# EAGLE design fc_board_rev_1 (EAGLE 5.12)
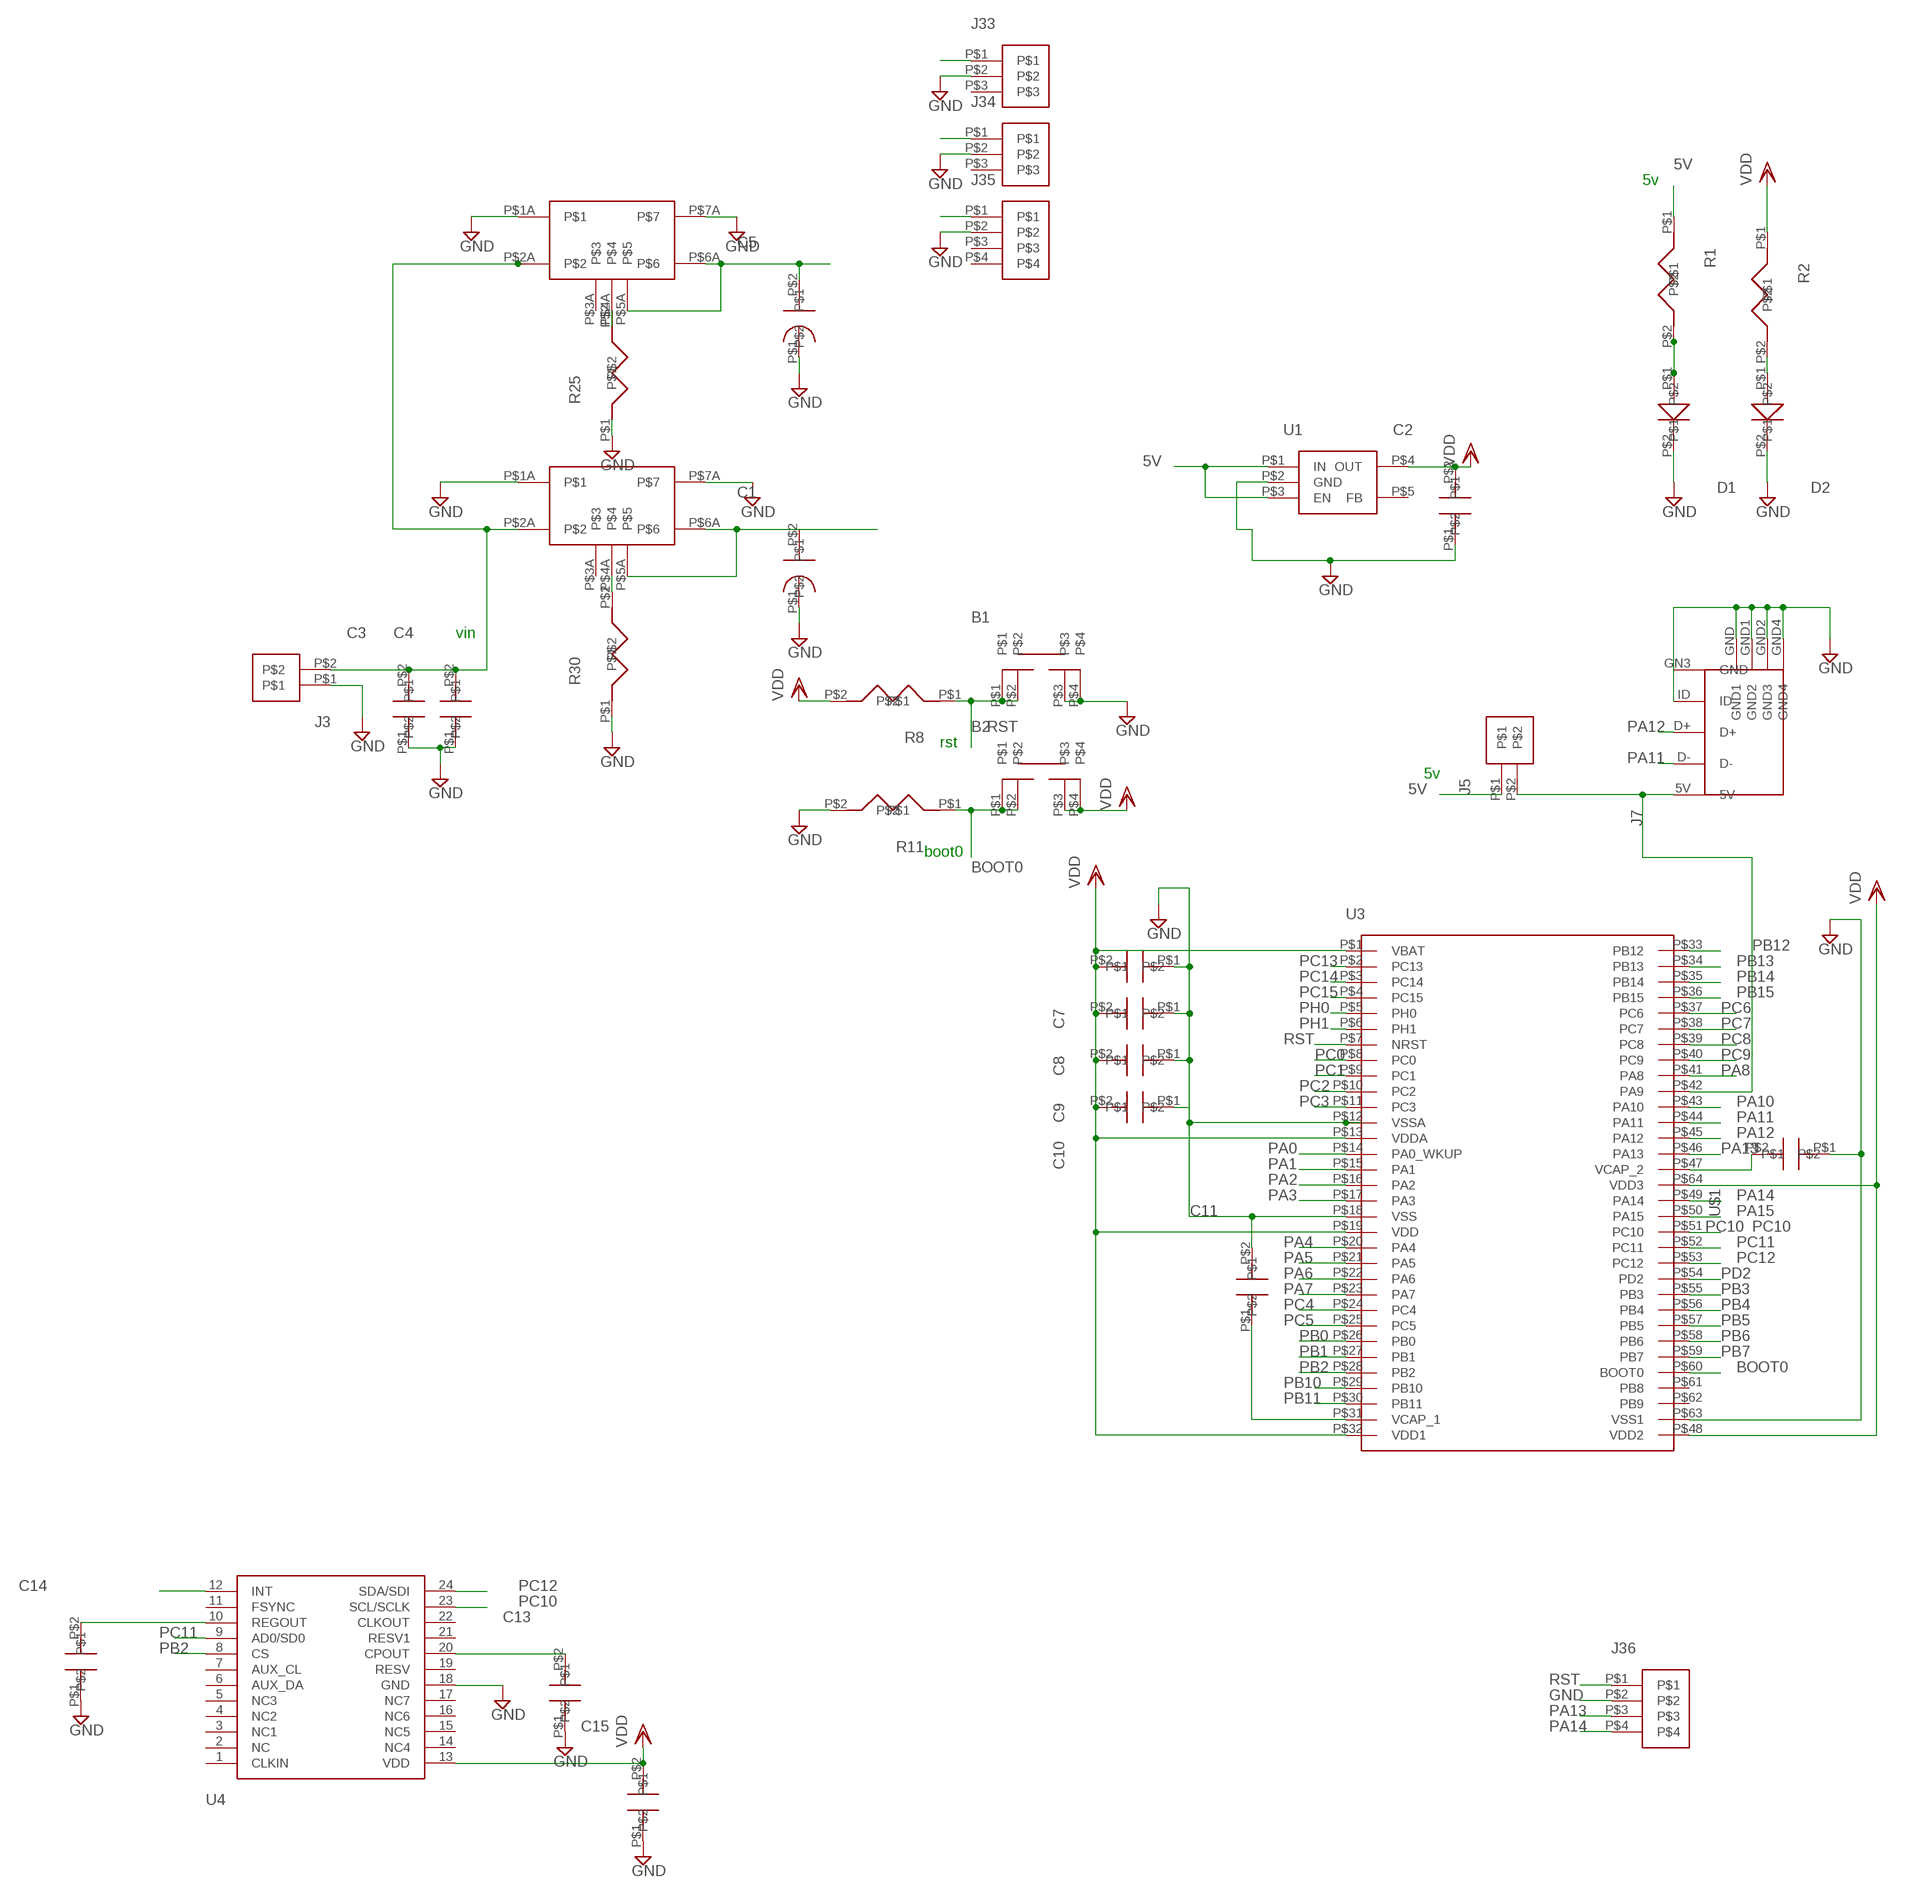
[diagram p0: schematic, sheet 1, part 1 of 2]
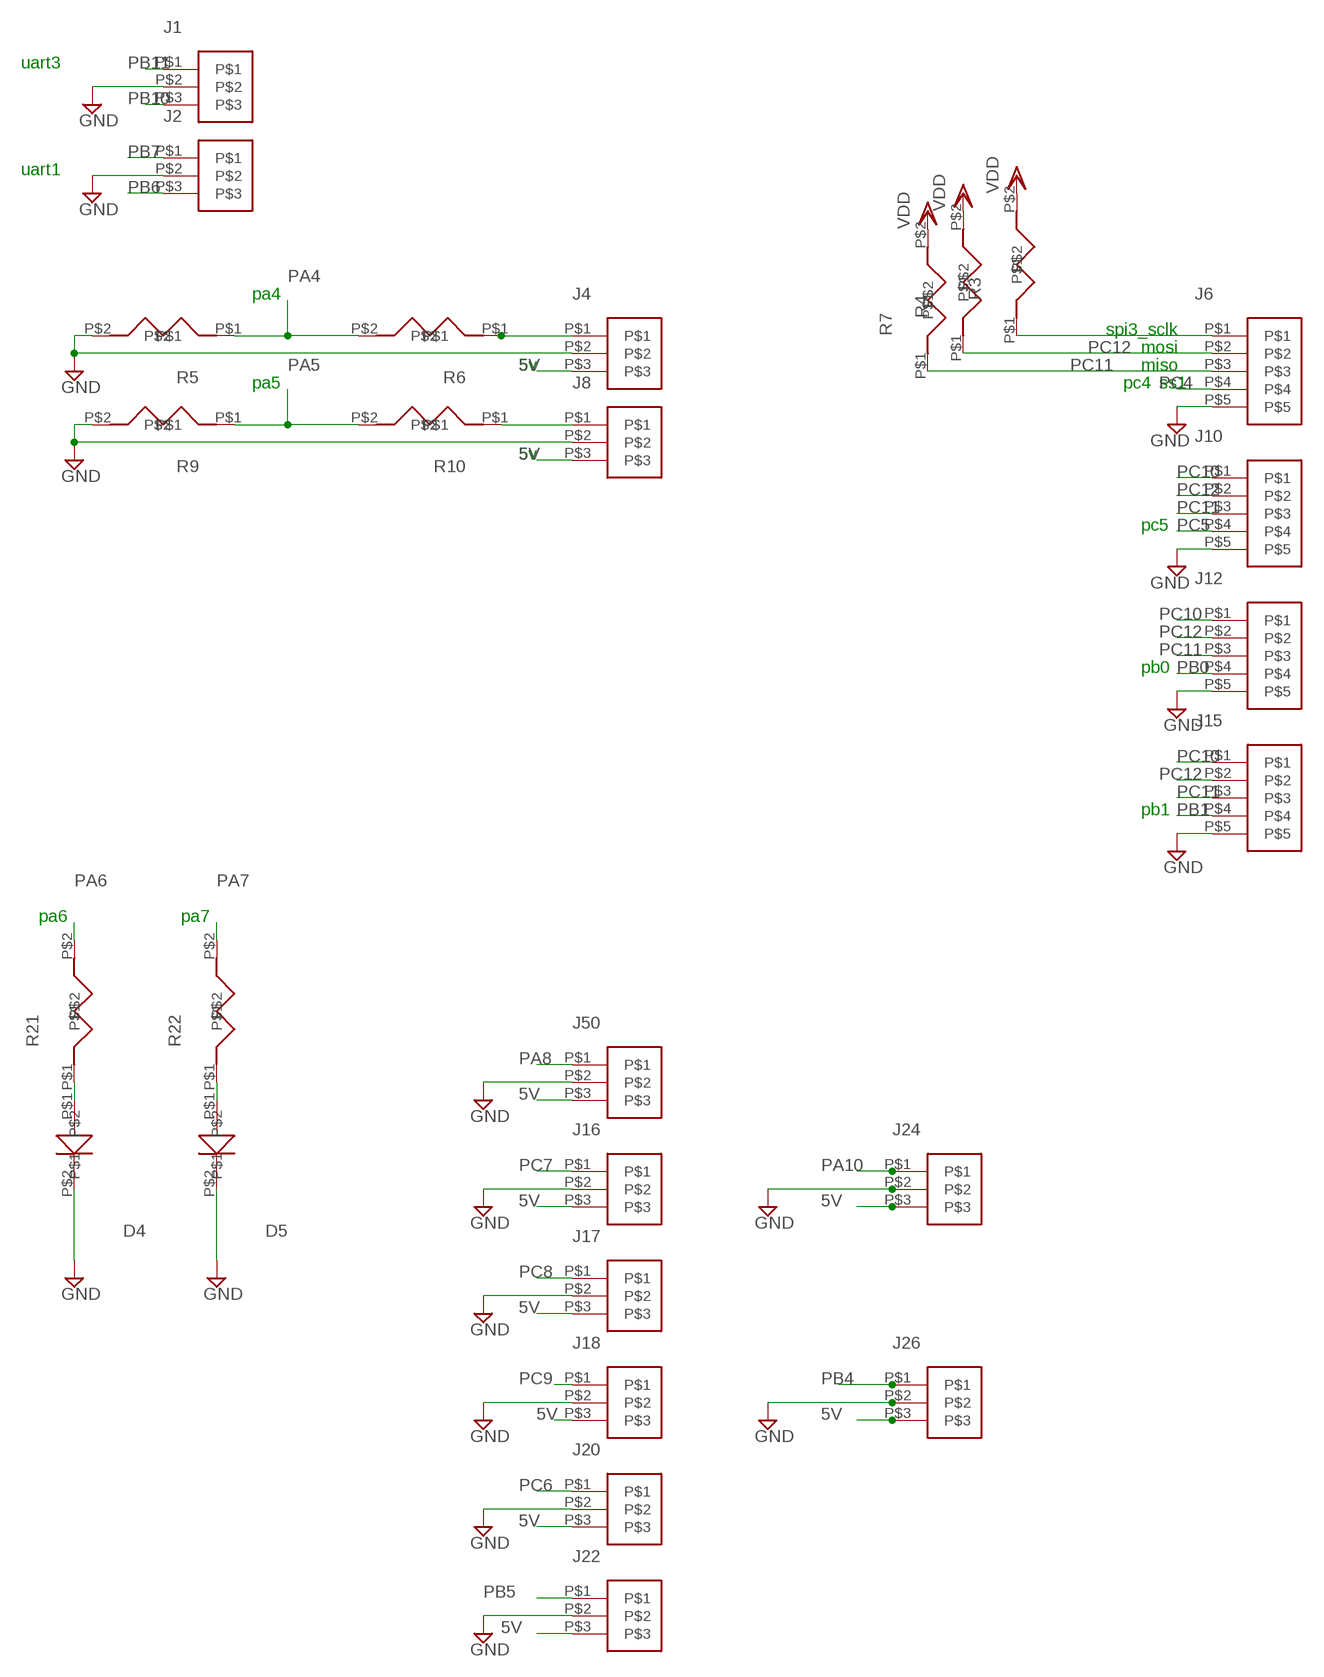
[diagram p1: schematic, sheet 1, part 2 of 2]

## Parts
B1  SM-BUTTON  [SM_BUTTON]
B2  SM-BUTTON  [SM_BUTTON]
C1  CAPACITOR-330UF  [330UF-CAPACITOR]
C2  2.2UF-CAP  [0603-CAPACITOR]
C3  2.2UF-CAP  [0603-CAPACITOR]
C4  2.2UF-CAP  [0603-CAPACITOR]
C5  CAPACITOR-330UF  [330UF-CAPACITOR]
C7  CAPACITOR-.1UF-4V  [0603-CAPACITOR]
C8  CAPACITOR-.1UF-4V  [0603-CAPACITOR]
C9  CAPACITOR-.1UF-4V  [0603-CAPACITOR]
C10  4.7UF-CAP6.3V  [0603-CAPACITOR]
C11  2.2UF-CAP  [0603-CAPACITOR]
C13  CAPACITOR-2.2NF-50V  [0603-CAPACITOR]
C14  CAPACITOR-.1UF-4V  [0603-CAPACITOR]
C15  CAPACITOR-.1UF-4V  [0603-CAPACITOR]
D1  RED_LED  [0603-CAPACITOR]
D2  RED_LED  [0603-CAPACITOR]
D4  RED_LED  [0603-CAPACITOR]
D5  ORANGE_LED  [0603-CAPACITOR]
J1  3-PIN-SHERLOCK  [3-PIN-2MM]
J2  3-PIN-SHERLOCK  [3-PIN-2MM]
J3  2-PIN-POWER  [2-PIN-3MM]
J4  3-PIN-SHERLOCK  [3-PIN-2MM]
J5  2-PIN-100MIL  [2PIN-100MIL]
J6  5-PIN-SHERLOCK  [5-PIN-2MM]
J7  USB_MINI_B  [USB_MINI_B]
J8  3-PIN-SHERLOCK  [3-PIN-2MM]
J10  5-PIN-SHERLOCK  [5-PIN-2MM]
J12  5-PIN-SHERLOCK  [5-PIN-2MM]
J15  5-PIN-SHERLOCK  [5-PIN-2MM]
J16  3-PIN-100-MIL  [3-PIN-10MIL]
J17  3-PIN-100-MIL  [3-PIN-10MIL]
J18  3-PIN-100-MIL  [3-PIN-10MIL]
J20  3-PIN-100-MIL  [3-PIN-10MIL]
J22  3-PIN-100-MIL  [3-PIN-10MIL]
J24  3-PIN-100-MIL  [3-PIN-10MIL]
J26  3-PIN-100-MIL  [3-PIN-10MIL]
J33  3-PIN-3MM  [3-PIN-3MM]
J34  3-PIN-3MM  [3-PIN-3MM]
J35  4-PIN-3MM  [4-PIN-3MM]
J36  4-PIN-SHERLOCK  [4-PIN-2MM]
J50  3-PIN-100-MIL  [3-PIN-10MIL]
R1  RESISTOR-4.7K-25V  [0603-CAPACITOR]
R2  RESISTOR-4.7K-25V  [0603-CAPACITOR]
R3  RESISTOR-4.7K-25V  [0603-CAPACITOR]
R4  RESISTOR-4.7K-25V  [0603-CAPACITOR]
R5  10K_RESISTOR  [0603-CAPACITOR]
R6  10K_RESISTOR  [0603-CAPACITOR]
R7  RESISTOR-4.7K-25V  [0603-CAPACITOR]
R8  RESISTOR-4.7K-25V  [0603-CAPACITOR]
R9  10K_RESISTOR  [0603-CAPACITOR]
R10  10K_RESISTOR  [0603-CAPACITOR]
R11  RESISTOR-4.7K-25V  [0603-CAPACITOR]
R21  RESISTOR-4.7K-25V  [0603-CAPACITOR]
R22  RESISTOR-4.7K-25V  [0603-CAPACITOR]
R25  732_RESISTOR  [0603-CAPACITOR]
R30  21K_RESISTOR  [0603-CAPACITOR]
U1  TPS73433-3.3-REG  [TPS73433-SOT5]
U3  STM32F405RG  [LQFP-64-STM32F405]
U4  MPU-6000  [QFN-ITG3200]
U$1  2.2UF-CAP  [0603-CAPACITOR]
U$2  WIDE_IN_REG  [WIDE_IN_REG]
U$4  WIDE_IN_REG  [WIDE_IN_REG]

## Nets
5V: C1.P$2 J4.P$3 J5.P$1 J8.P$3 J16.P$3 J17.P$3 J18.P$3 J20.P$3 J22.P$3 J24.P$3 J26.P$3 J33.P$1 J34.P$1 J50.P$3 R1.P$1 U1.P$1(IN) U1.P$3(EN) U$2.P$5A U$2.P$6A
12V: C5.P$2 J35.P$1 U$4.P$5A U$4.P$6A
BOOT0: B2.P$1 B2.P$2 R11.P$1 U3.P$60(BOOT0)
GND: B1.P$3 B1.P$4 C1.P$1 C2.P$1 C3.P$1 C4.P$1 C5.P$1 C7.P$1 C8.P$1 C9.P$1 C10.P$1 C11.P$2 C13.P$1 C14.P$1 C15.P$1 D1.P$2 D2.P$2 D4.P$2 D5.P$2 J1.P$2 J2.P$2 J3.P$1 J4.P$2 J6.P$5 J7.GN3(GND) J7.GND1(GND2) J7.GND2(GND3) J7.GND4 J7.GND(GND1) J7.ID J8.P$2 J10.P$5 J12.P$5 J15.P$5 J16.P$2 J17.P$2 J18.P$2 J20.P$2 J22.P$2 J24.P$2 J26.P$2 J33.P$2 J34.P$2 J35.P$2 J36.P$2 J50.P$2 R5.P$2 R9.P$2 R11.P$2 R25.P$1 R30.P$1 U1.P$2(GND) U3.P$12(VSSA) U3.P$18(VSS) U3.P$63(VSS1) U4.18(GND) U$1.P$1 U$2.P$1A U$2.P$7A U$4.P$1A U$4.P$7A
ITG3200_INT: U4.12(INT)
N$1: C13.P$2 U4.20(CPOUT)
N$3: J4.P$1 R6.P$1
N$4: D4.P$1 R21.P$1
N$5: R30.P$2 U$2.P$4A
N$6: J8.P$1 R10.P$1
N$7: D5.P$1 R22.P$1
N$8: U3.P$47(VCAP_2) U$1.P$2
N$9: C11.P$1 U3.P$31(VCAP_1)
N$10: D2.P$1 R2.P$2
N$12: D1.P$1 R1.P$2
N$15: R25.P$2 U$4.P$4A
N$16: C14.P$2 U4.10(REGOUT)
PA0: U3.P$14(PA0_WKUP)
PA1: U3.P$15(PA1)
PA2: U3.P$16(PA2)
PA3: U3.P$17(PA3)
PA4: R5.P$1 R6.P$2 U3.P$20(PA4)
PA5: R9.P$1 R10.P$2 U3.P$21(PA5)
PA6: R21.P$2 U3.P$22(PA6)
PA7: R22.P$2 U3.P$23(PA7)
PA8: J50.P$1 U3.P$41(PA8)
PA9: J5.P$2 J7.5V U3.P$42(PA9)
PA10: J24.P$1 U3.P$43(PA10)
PA11: J7.D- U3.P$44(PA11)
PA12: J7.D+ U3.P$45(PA12)
PA13: J36.P$3 U3.P$46(PA13)
PA14: J36.P$4 U3.P$49(PA14)
PA15: U3.P$50(PA15)
PB0: J12.P$4 U3.P$26(PB0)
PB1: J15.P$4 U3.P$27(PB1)
PB2: U3.P$28(PB2) U4.8(CS)
PB3: U3.P$55(PB3)
PB4: J26.P$1 U3.P$56(PB4)
PB5: J22.P$1 U3.P$57(PB5)
PB6: J2.P$3 U3.P$58(PB6)
PB7: J2.P$1 U3.P$59(PB7)
PB10: J1.P$3 U3.P$29(PB10)
PB11: J1.P$1 U3.P$30(PB11)
PB12: U3.P$33(PB12)
PB13: U3.P$34(PB13)
PB14: U3.P$35(PB14)
PB15: U3.P$36(PB15)
PC0: U3.P$8(PC0)
PC1: U3.P$9(PC1)
PC2: U3.P$10(PC2)
PC3: U3.P$11(PC3)
PC4: J6.P$4 U3.P$24(PC4)
PC5: J10.P$4 U3.P$25(PC5)
PC6: J20.P$1 U3.P$37(PC6)
PC7: J16.P$1 U3.P$38(PC7)
PC8: J17.P$1 U3.P$39(PC8)
PC9: J18.P$1 U3.P$40(PC9)
PC10: J6.P$1 J10.P$1 J12.P$1 J15.P$1 R3.P$1 U3.P$51(PC10) U4.23(SCL/SCLK)
PC11: J6.P$3 J10.P$3 J12.P$3 J15.P$3 R7.P$1 U3.P$52(PC11) U4.9(AD0/SD0)
PC12: J6.P$2 J10.P$2 J12.P$2 J15.P$2 R4.P$1 U3.P$53(PC12) U4.24(SDA/SDI)
PC13: U3.P$2(PC13)
PC14: U3.P$3(PC14)
PC15: U3.P$4(PC15)
PD2: U3.P$54(PD2)
PH0: U3.P$5(PH0)
PH1: U3.P$6(PH1)
RST: B1.P$1 B1.P$2 J36.P$1 R8.P$1 U3.P$7(NRST)
VDD: B2.P$3 B2.P$4 C2.P$2 C7.P$2 C8.P$2 C9.P$2 C10.P$2 C15.P$2 R2.P$1 R3.P$2 R4.P$2 R7.P$2 R8.P$2 U1.P$4(OUT) U3.P$1(VBAT) U3.P$13(VDDA) U3.P$19(VDD) U3.P$32(VDD1) U3.P$48(VDD2) U3.P$64(VDD3) U4.13(VDD)
VIN: C3.P$2 C4.P$2 J3.P$2 U$2.P$2A U$4.P$2A
Unconnected: J33.P$3 J34.P$3 J35.P$3 J35.P$4 U1.P$5(FB) U3.P$61(PB8) U3.P$62(PB9) U4.1(CLKIN) U4.2(NC) U4.3(NC1) U4.4(NC2) U4.5(NC3) U4.6(AUX_DA) U4.7(AUX_CL) U4.11(FSYNC) U4.14(NC4) U4.15(NC5) U4.16(NC6) U4.17(NC7) U4.19(RESV) U4.21(RESV1) U4.22(CLKOUT) U$2.P$3A U$4.P$3A

## Notes on the sheet
- 5v
- uart3
- uart1
- vin
- pa4
- spi3_sclk
- mosi
- 5v | miso
- pa5 | pc4 | ss1
- rst
- 5v
- 5v
- boot0 | pc5
- pb0
- pb1
- pa6 | pa7

## Library data of the parts
B1 B2 = aerial:SM-BUTTON
C1 C5 = aerial:CAPACITOR-330UF
C2-C4 C11 U$1 = aerial:2.2UF-CAP
C7-C9 C14 C15 = aerial:CAPACITOR-.1UF-4V
C10 = aerial:4.7UF-CAP6.3V
C13 = aerial:CAPACITOR-2.2NF-50V
D1 D2 D4 = aerial:RED_LED
D5 = aerial:ORANGE_LED
J1 J2 J4 J8 = aerial:3-PIN-SHERLOCK
J3 = aerial:2-PIN-POWER
J5 = aerial:2-PIN-100MIL
J6 J10 J12 J15 = aerial:5-PIN-SHERLOCK
J7 = aerial:USB_MINI_B
J16-J18 J20 J22 J24 J26 J50 = aerial:3-PIN-100-MIL
J33 J34 = aerial:3-PIN-3MM
J35 = aerial:4-PIN-3MM
J36 = aerial:4-PIN-SHERLOCK
R1-R4 R7 R8 R11 R21 R22 = aerial:RESISTOR-4.7K-25V
R5 R6 R9 R10 = aerial:10K_RESISTOR
R25 = aerial:732_RESISTOR
R30 = aerial:21K_RESISTOR
U1 = aerial:TPS73433-3.3-REG
U3 = aerial:STM32F405RG
U4 = aerial:MPU-6000
U$2 U$4 = aerial:WIDE_IN_REG

## Board
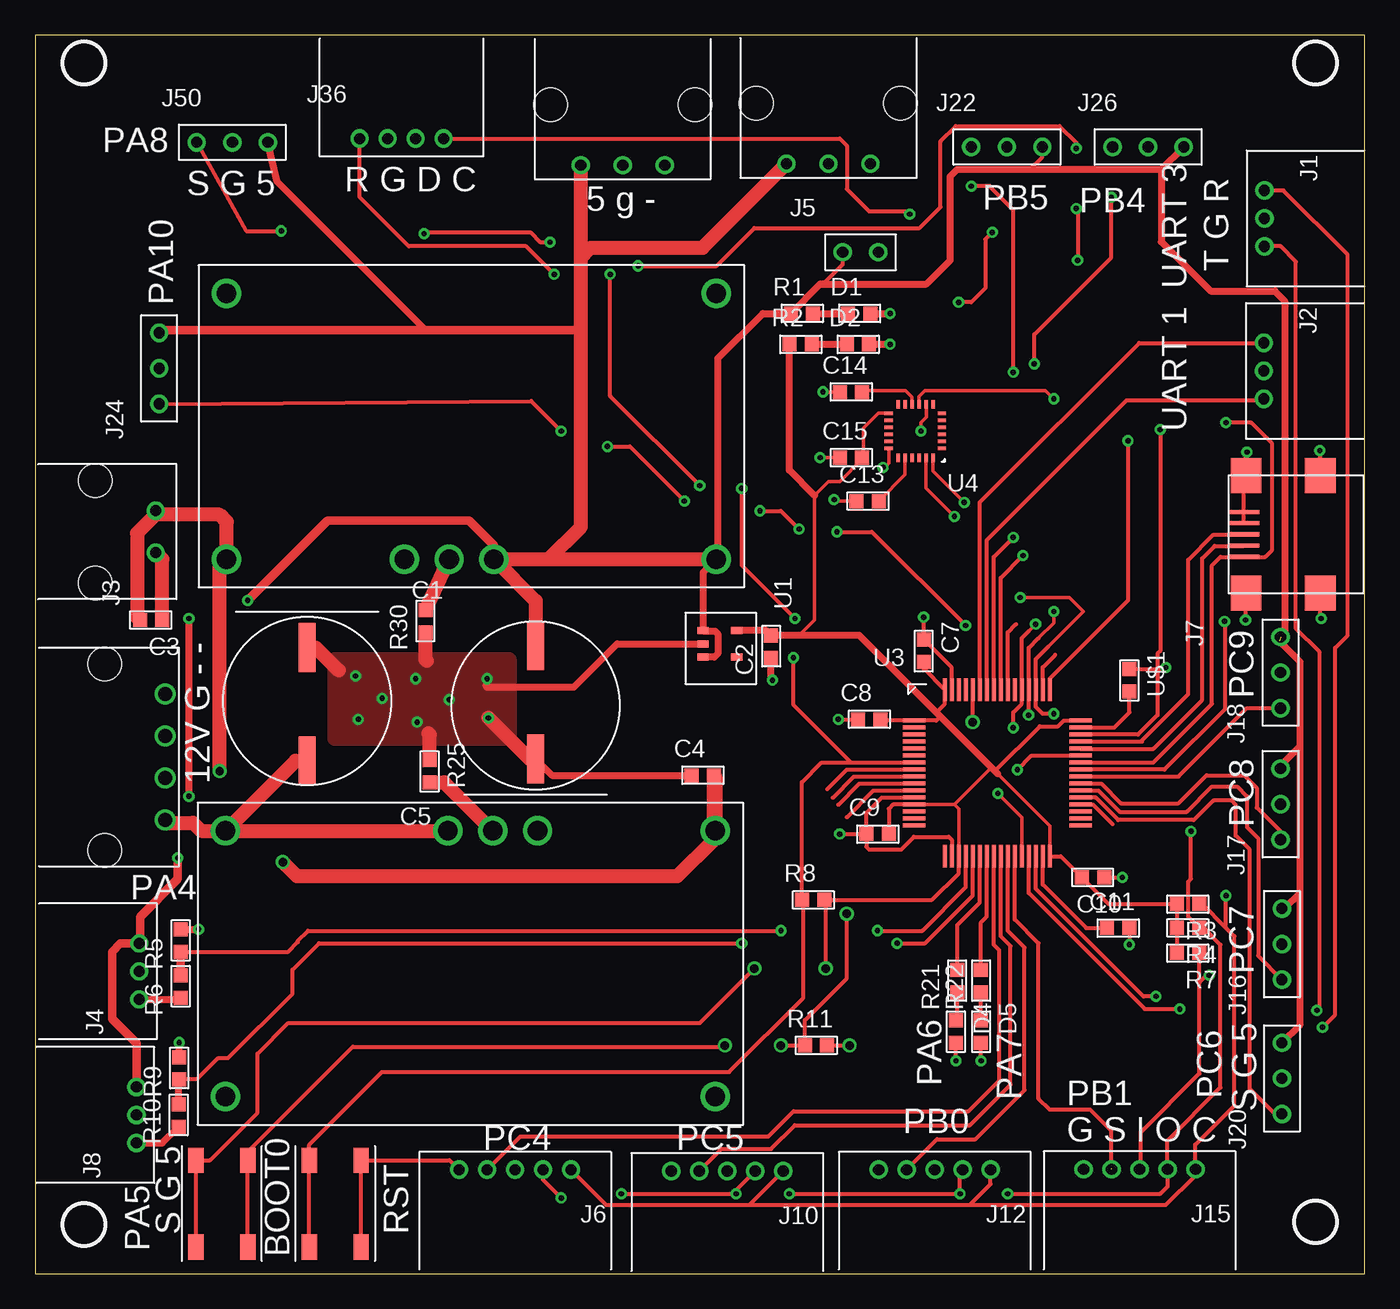
[diagram p2: board, top side]
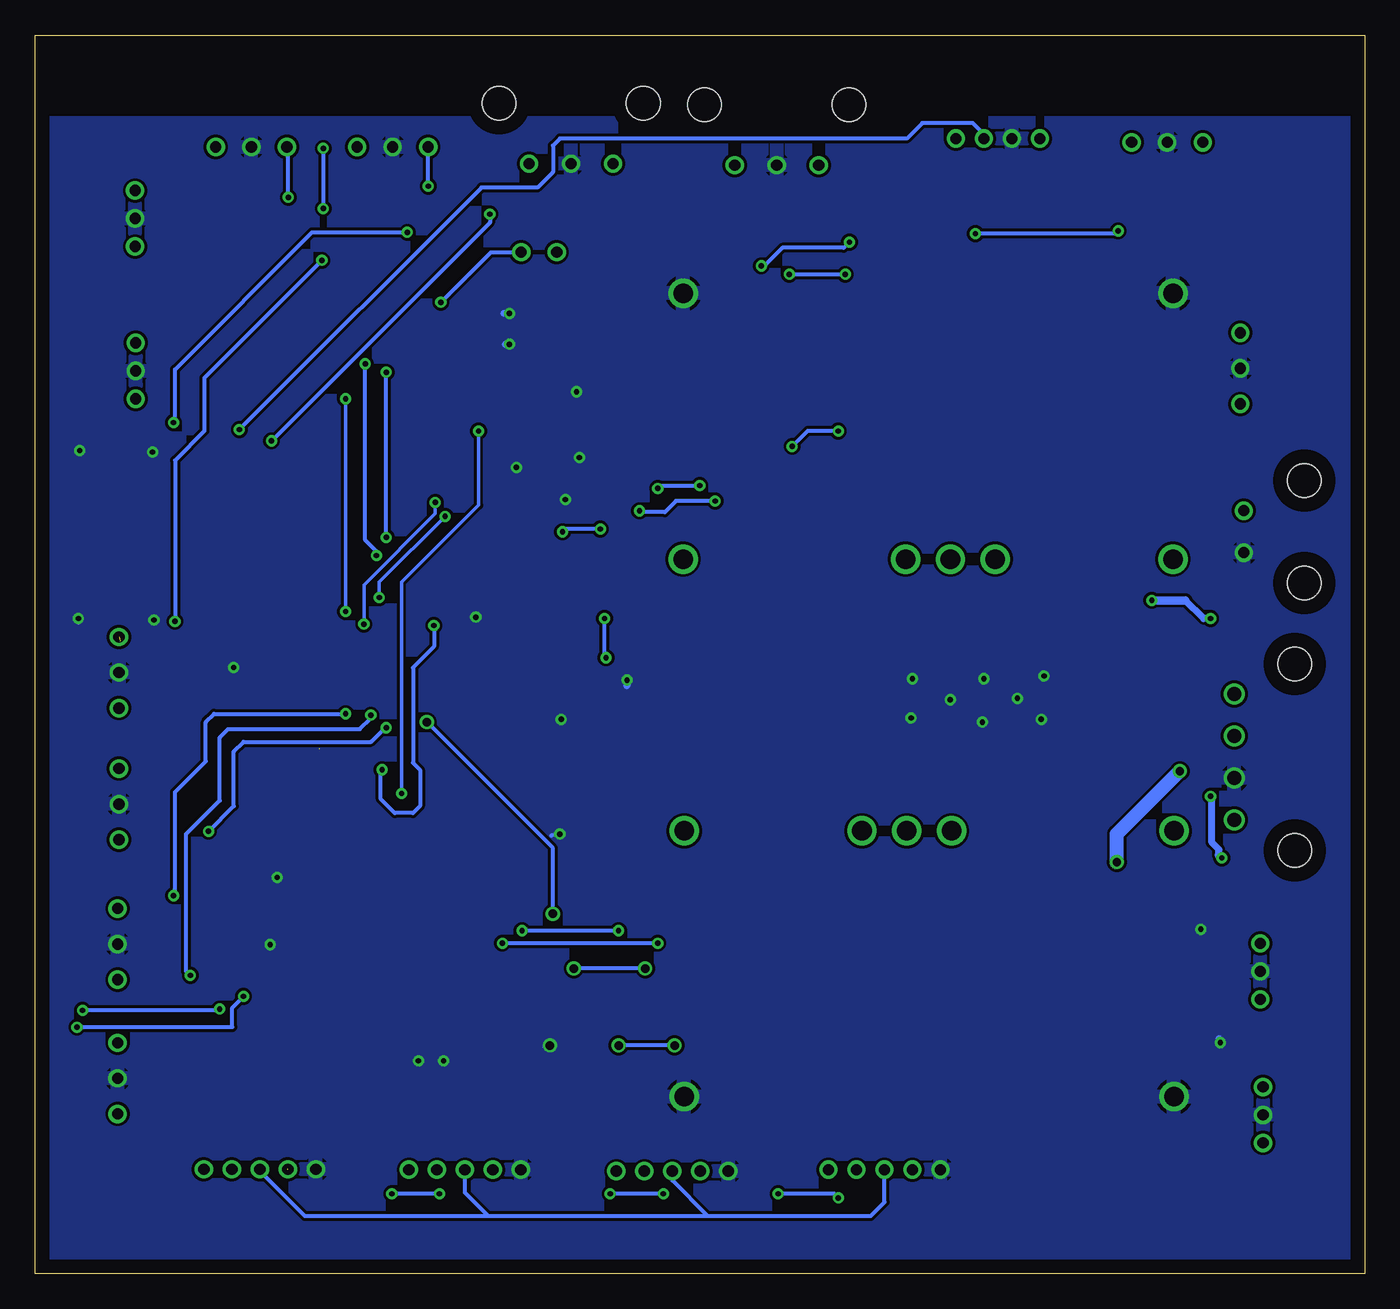
[diagram p3: board, bottom side, seen from below]

Size 95 x 88.5 mm. Coordinates in mm from the lower left corner, seen from the top.
Outline: 0,0 95,0 95,88.5 0,88.5 0,0
Copper layers (1*16): Top 0.035mm / dielectric 1.5mm / Bottom 0.035mm
Design rules "default": minimum track width 10mil, minimum drill 24mil, track to track 8mil, track to pad 8mil, pad to pad 8mil, via to via 8mil, smd to smd 8mil, copper to edge 40mil, drill to drill 8mil, minimum pad ring 10mil, minimum via ring 8mil, stop-mask expansion 4mil, vias tented up to drill 0mil, thermal gap 10mil

### Footprints (pad centres in the part's own frame; a part is rotated, then mirrored left to right if it is on the bottom)
SM_BUTTON = smd 1.8 x 1.1: P$1 0,0; P$2 6.2,0; P$3 0,3.7; P$4 6.2,3.7
330UF-CAPACITOR = smd 1.2 x 3.5: P$1 0,0; P$2 0,8.1
0603-CAPACITOR = smd 1 x 1: P$1 0,0; P$2 1.6,0
3-PIN-2MM = drill 0.8 round: P$1 0,0; P$2 2,0; P$3 4,0
2-PIN-3MM = drill 0.8 round: P$1 0,0; P$2 3,0 | hole 2.41: -2.16,4.32; 5.15,4.32
2PIN-100MIL = drill 0.8 round: P$1 0,0; P$2 2.54,0
5-PIN-2MM = drill 0.8 round: P$1 0,0; P$2 2,0; P$3 4,0; P$4 6,0; P$5 8,0
USB_MINI_B = smd 0.3 x 2.2: 5V 2.6,8.55; D+ 4.2,8.55; D- 3.4,8.55; GND 5.8,8.55; ID 5,8.55 | smd 2.5 x 2.2: GN3 8.4,3.1; GND1 0,8.4; GND2 0,3.1; GND4 8.4,8.4
3-PIN-10MIL = drill 0.8 round: P$1 0,0; P$2 2.54,0; P$3 5.08,0
3-PIN-3MM = drill 0.8 round: P$1 0,0; P$2 3,0; P$3 6,0 | hole 2.41: -2.16,4.32; 8.15,4.32
4-PIN-3MM = drill 1 round: P$1 0,0; P$2 3,0; P$3 6,0; P$4 9,0 | hole 2.41: -2.16,4.32; 11.15,4.32
4-PIN-2MM = drill 0.8 round: P$1 0,0; P$2 2,0; P$3 4,0; P$4 6,0
TPS73433-SOT5 = smd 0.5 x 0.8: P$1 0,0; P$2 0.95,0; P$3 1.9,0; P$4 0,2.4; P$5 1.9,2.4
LQFP-64-STM32F405 = smd 1.6 x 0.3: P$1 0.4,10.1; P$2 0.4,9.6; P$3 0.4,9.1; P$4 0.4,8.6; P$5 0.4,8.1; P$6 0.4,7.6; P$7 0.4,7.1; P$8 0.4,6.6; P$9 0.4,6.1; P$10 0.4,5.6; P$11 0.4,5.1; P$12 0.4,4.6; P$13 0.4,4.1; P$14 0.4,3.6; P$15 0.4,3.1; P$16 0.4,2.6; P$33 12.3,2.6; P$34 12.3,3.1; P$35 12.3,3.6; P$36 12.3,4.1; P$37 12.3,4.6; P$38 12.3,5.1; P$39 12.3,5.6; P$40 12.3,6.1; P$41 12.3,6.6; P$42 12.3,7.1; P$43 12.3,7.6; P$44 12.3,8.1; P$45 12.3,8.6; P$46 12.3,9.1; P$47 12.3,9.6; P$48 12.3,10.1 | smd 0.3 x 1.6: P$17 2.6,0.4; P$18 3.1,0.4; P$19 3.6,0.4; P$20 4.1,0.4; P$21 4.6,0.4; P$22 5.1,0.4; P$23 5.6,0.4; P$24 6.1,0.4; P$25 6.6,0.4; P$26 7.1,0.4; P$27 7.6,0.4; P$28 8.1,0.4; P$29 8.6,0.4; P$30 9.1,0.4; P$31 9.6,0.4; P$32 10.1,0.4; P$49 10.1,12.3; P$50 9.6,12.3; P$51 9.1,12.3; P$52 8.6,12.3; P$53 8.1,12.3; P$54 7.6,12.3; P$55 7.1,12.3; P$56 6.6,12.3; P$57 6.1,12.3; P$58 5.6,12.3; P$59 5.1,12.3; P$60 4.6,12.3; P$61 4.1,12.3; P$62 3.6,12.3; P$63 3.1,12.3; P$64 2.6,12.3
QFN-ITG3200 = smd 0.6 x 0.25: 1 0.1,3.225; 2 0.1,2.725; 3 0.1,2.225; 4 0.1,1.725; 5 0.1,1.225; 6 0.1,0.725; 13 3.9,0.725; 14 3.9,1.225; 15 3.9,1.725; 16 3.9,2.225; 17 3.9,2.725; 18 3.9,3.225 | smd 0.25 x 0.6: 7 0.725,0.1; 8 1.225,0.1; 9 1.725,0.1; 10 2.225,0.1; 11 2.725,0.1; 12 3.225,0.1; 19 3.225,3.9; 20 2.725,3.9; 21 2.225,3.9; 22 1.725,3.9; 23 1.225,3.9; 24 0.725,3.9
WIDE_IN_REG = drill 1.4 round: P$1A 2,21; P$2A 2,2; P$3A 14.7,2; P$4A 17.9,2; P$5A 21.1,2; P$6A 37,2; P$7A 37,21

### Placement (x,y rotation side)
B1  19.6,8.1 270 top
B2  15.2,1.9 90 top
C1  35.77,36.77 0 top
C2  52.6,44 90 top
C3  9.1,46.7 180 top
C4  46.9,35.6 0 top
C5  19.44,44.73 180 top
C7  63.5,45.3 270 top
C8  58.8,39.6 0 top
C9  59.4,31.4 0 top
C10  76.4,28.3 180 top
C11  76.58,24.68 0 top
C13  58.7,55.2 0 top
C14  57.5,63 0 top
C15  57.5,58.3 0 top
D1  58.1,68.6 0 top
D2  58,66.4 0 top
D4  65.8,18.1 270 top
D5  67.6,18.1 270 top
J1  87.85,77.39 270 top
J2  87.8,66.5 270 top
J3  8.62,51.51 90 top
J4  7.45,19.59 90 top
J5  57.72,72.98 0 top
J6  38.3,7.42 180 top
J7  94.93,48.62 90 top
J8  7.25,9.33 90 top
J10  53.46,7.32 180 top
J12  68.28,7.42 180 top
J15  82.93,7.45 180 top
J16  89.1,21 90 top
J17  89,31 90 top
J18  89,40.4 90 top
J20  89.1,11.4 90 top
J22  66.9,80.5 0 top
J24  8.87,62.14 90 top
J26  77,80.5 0 top
J33  53.7,79.3 0 top
J34  39,79.2 0 top
J35  9.3,32.4 90 top
J36  23.2,81.1 0 top
J50  11.56,80.83 0 top
R1  54,68.6 0 top
R2  53.9,66.4 0 top
R3  83.2,26.4 180 top
R4  83.2,24.7 180 top
R5  10.41,22.98 90 top
R6  10.41,19.7 90 top
R7  83.2,22.9 180 top
R8  54.8,26.7 0 top
R9  10.31,13.86 90 top
R10  10.27,10.5 90 top
R11  55,16.3 0 top
R21  65.9,20.1 90 top
R22  67.6,20.1 90 top
R25  28.2,36.7 270 top
R30  27.9,45.8 90 top
U1  47.74,45.94 270 top
U3  62.41,29.41 0 top
U4  64.9,62.2 180 top
U$1  78.2,43.2 270 top
U$2  11.69,49.05 0 top
U$4  50.61,33.63 180 top

### Tracks (layer width: path | path; a pad name or v marks a point on that pad's centre or on a via)
5V  (via drill 0.38)  (1 unrouted)
  Top 0.3: J5.P$1 57.72,72.12 56.3,70.7 | J22.P$3 71.98,79.78 71.1,78.9
  Top 0.5: U1.P$3 48.54,44.04 48.8,44.3 48.8,45.7 48.6,45.9 47.78,45.9 U1.P$1 47.74,50.1 U$2.P$6A 48.8,51.16 48.8,65.4 52,68.6 R1.P$1 56.1,70.7 56.3,70.7 63.7,70.7 65.4,72.4 65.4,78.4 65.9,78.9 71.1,78.9 80.48,78.9 | 88.92,45.18 90.4,43.7 90.4,37.7 | 90.4,27.2 90.4,37.7 | J18.P$3 89.3,45.78 89.3,69.5 88.6,70.2 84,70.2 80.48,73.72 80.48,78.9 | J17.P$3 89,36.3 90.4,37.7 | J16.P$3 89.28,26.08 90.4,27.2 | 90.4,27.2 90.4,17.78 J20.P$3 | J50.P$3 17.29,78.03 27.9,67.42 | 80.48,78.9 J26.P$3 | v11,34.1 v11,46.8
  Top 0.6: U$2.P$5A 32.79,52.01 31,53.8 20.9,53.8 v15.2,48.1 | J8.P$3 7.25,16.45 5.5,18.2 5.5,23 6.1,23.6 J4.P$3 7.5,23.64 7.5,25.5 10.2,28.2 v10.2,29.7 | 39,67.1 38.68,67.42 27.9,67.42 9.07,67.42 J24.P$3
  Top 1: C1.P$2 35.77,48.07 U$2.P$5A 36.7,51.05 | 36.7,51.05 U$2.P$6A | 39,72.6 39,67.1 39,53.35 36.7,51.05 | 39,72.6 J34.P$1 | J33.P$1 47.7,73.3 39.7,73.3 39,72.6
  Bottom 0.5: 10.4,29.9 10.4,30.3 10.9,30.8 10.9,34 v11,34.1 | v11,46.8 11.5,46.8 12.8,48.1
  Bottom 0.6: 12.8,48.1 v15.2,48.1 | v10.2,29.7 10.4,29.9
12V
  Top 1: C5.P$2 18.61,36.63 U$4.P$6A | U$4.P$6A U$4.P$5A | U$4.P$6A 11.87,31.63 11.3,32.2 9.5,32.2 J35.P$1
BOOT0  (via drill 0.6)
  Top 0.3: B2.P$1 B2.P$2 15.2,8.7 22.7,16.2 49.2,16.2 v49.3,16.3 | v53.3,16.3 R11.P$1 55,18.1 58,21.1 v58,25.7 | v67,39.4 U3.P$60
  Bottom 0.3: v49.3,16.3 v53.3,16.3 | v58,25.7 58,30.4 v67,39.4
GND  (via drill 0.38, 0.6)
  Top 0.25: C14.P$1 v56.3,63 | C15.P$1 v56.1,58.3 | C13.P$1 57.2,55.2 v57.1,55.3 | U4.18 61,57.9 60.7,57.6 v60.6,57.6
  Top 0.3: U3.P$63 65.51,43.29 C7.P$1 v63.5,46.9 | v57.4,39.6 C8.P$1 | U3.P$12 60.51,34.01 59.4,32.9 C9.P$1 | C10.P$1 v77.7,28.3 | U3.P$18 65.51,30.99 65.3,31.2 62.8,31.2 61.9,30.3 59.6,30.3 59.4,30.5 C9.P$1 | v65.8,15.2 D4.P$2 | v67.6,15.2 D5.P$2 | v57.5,31.4 C9.P$1 | 80.9,43.2 v80.8,43.3 80.7,43.2 U$1.P$1 | J7.GND1 86.53,46.73 v86.5,46.7 | J7.GND2 91.83,46.87 v91.9,46.8 | J7.ID J7.GND 86.38,56.87 J7.GND4 86.53,58.63 v86.6,58.7 | J7.GN3 91.83,58.77 v91.8,58.8 | J6.P$5 29.62,8.1 B1.P$3 B1.P$4 | R11.P$2 v58.2,16.3 | C11.P$2 78.18,23.52 v78.2,23.5
  Top 0.5: U1.P$2 41.59,44.99 38.5,41.9 32.3,41.9 32.2,42 | C4.P$1 36.94,35.6 C1.P$1 | C2.P$1 52.6,42.5 v52.7,42.4 | D1.P$2 v61.1,68.6 | D2.P$2 v61.1,66.4 | R9.P$2 v10.31,16.49 v10.3,16.5 | R5.P$2 11.68,24.58 v11.7,24.6
  Top 1: R30.P$1 27.9,43.9 28,43.8 | R25.P$1 28.2,38.5 28.1,38.6 | C5.P$1 20.07,44.73 21.7,43.1 | C1.P$1 35.33,36.77 v32.4,39.7 | C3.P$1 9.1,51.03 J3.P$1
  Bottom 0.25: v56.3,63 56.1,63 | v56.1,58.3 56,58.3 | v57.1,55.3 57,55.3 | v60.6,57.6 60.5,57.5
  Bottom 0.3: v63.5,46.9 63.5,47.1 | v57.4,39.6 57.2,39.6 | v77.7,28.3 77.8,28.3 | v65.8,15.2 65.8,15 | v67.6,15.2 67.6,15.1 | v57.5,31.4 58.1,31.3 | v80.8,43.3 80.8,43.4 80.9,43.5 | v86.5,46.7 86.5,46.5 | v91.9,46.8 91.9,46.5 | v86.6,58.7 86.6,58.9 | v91.8,58.8 91.8,58.9 | v58.2,16.3 58.5,16.3 58.6,16.2 | v78.2,23.5 78.2,23.3
  Bottom 0.5: v52.7,42.4 52.7,42 | v61.1,68.6 61.5,68.6 | v61.1,66.4 61.4,66.4 | v10.3,16.5 10.3,16.7 10.4,16.8 | v11.7,24.6 11.8,24.6
  other vias: 23.1,39.6 22.9,42.7 24.8,41.1 27.3,39.4 27.2,42.5 29.6,41 32.3,42.5
  pour Bottom: 0.5,82.2 95,82.2 95,0.9 0.5,0.9
  pour Top: 21.4,43.9 33.9,43.9 33.9,38.2 21.4,38.2
N$1
  Top 0.25: U4.20 62.17,57.08 C13.P$2
N$3
  Top 0.5: J4.P$1 10.3,19.59 R6.P$1
N$4
  Top 0.3: R21.P$1 65.9,18.2 D4.P$1
N$5
  Top 1: R30.P$2 U$2.P$4A
N$6
  Top 0.5: J8.P$1 9.1,9.33 R10.P$1
N$7
  Top 0.3: D5.P$1 R22.P$1
N$8
  Top 0.3: U3.P$47 77.11,39.01 78.2,40.1 U$1.P$2
N$9
  Top 0.3: U3.P$31 72.01,27.79 75.12,24.68 C11.P$1
N$10
  Top 0.5: R2.P$2 D2.P$1
N$12
  Top 0.5: R1.P$2 D1.P$1
N$15
  Top 1: R25.P$2 29.24,35.1 U$4.P$4A
N$16
  Top 0.25: U4.10 62.67,62.62 62.2,63.1 59.2,63.1 C14.P$2
PA4  (via drill 0.38)
  Top 0.3: U3.P$20 66.51,27.61 63.4,24.5 v60.2,24.5 | v53.3,24.5 19.5,24.5 18.78,23.78 18.78,23.68 18.1,23 10.43,23 R5.P$1
  Top 0.6: R6.P$2 R5.P$1
  Bottom 0.3: v53.3,24.5 v60.2,24.5
PA5  (via drill 0.38)
  Top 0.3: U3.P$21 67.01,27.01 63.6,23.6 v61.6,23.6 | v50.5,23.6 20.3,23.6 18.4,21.7 18.4,20 13.8,15.4 13.1,15.4 11.6,13.9 10.35,13.9 R9.P$1
  Top 0.5: R10.P$2 10.27,13.82 R9.P$1
  Bottom 0.3: v50.5,23.6 v61.6,23.6
PA6
  Top 0.3: U3.P$22 67.51,26.51 65.9,24.9 R21.P$2
PA7
  Top 0.3: U3.P$23 68.01,25.51 67.6,25.1 R22.P$2
PA8  (via drill 0.38)
  Top 0.3: U3.P$41 80.71,36.01 85,40.3 v85,46.6 | v74.5,72.4 74.5,76 v74.4,76.1 | v43.1,72 48.7,72 51.4,74.7 63.2,74.7 64.7,76.2 64.7,80.9 65.8,82 73.2,82 74.4,80.8 v74.4,80.4 | v36.8,73.7 36.1,73.7 35.4,74.4 27.9,74.4 v27.8,74.3 | v17.6,74.5 15.09,74.5 J50.P$1
  Bottom 0.3: v85,46.6 85,58.1 82.9,60.2 82.9,64 v74.5,72.4 | v43.1,72 42.9,72 41.6,73.3 37.2,73.3 v36.8,73.7 | v27.8,74.3 17.8,74.3 v17.6,74.5 | v74.4,80.4 v74.4,76.1
PA9  (via drill 0.38)
  Top 0.3: U3.P$42 79.91,36.51 84.1,40.7 84.1,50.6 84.7,51.2 86.36,51.2 J7.5V 86.4,51.2 87.9,51.2 88.4,51.7 88.4,59.3 86.9,60.8 v85.1,60.8 | v66,69.4 66.9,69.4 67.9,70.4 67.9,73.9 v68.4,74.4
  Bottom 0.3: J5.P$2 62.42,72.98 v66,69.4 | v68.4,74.4 75.2,74.4 85,64.6 85,60.9 v85.1,60.8
PA10  (via drill 0.38)
  Top 0.3: J24.P$1 35.46,62.34 v37.6,60.2 | v40.9,59.1 42.5,59.1 v46.4,55.2 | v51.8,54.5 53.3,54.5 v54.6,53.2 | v57.3,53 59.8,53 v66.5,46.3 | 70.3,36.2 70.2,36.1 v70.2,36 71.21,37.01 U3.P$43
  Bottom 0.3: v37.6,60.2 39.8,60.2 v40.9,59.1 | v46.4,55.2 49.2,55.2 50,54.4 51.7,54.4 v51.8,54.5 | v54.6,53.2 57.1,53.2 v57.3,53 | v66.5,46.3 66.5,44.8 68,43.3 68,36.5 67.5,36 67.5,33.4 68,32.9 69.3,32.9 70.3,33.9 70.3,35.9 v70.2,36
PA11  (1 unrouted)
  Top 0.3: U3.P$44 | U3.P$44 79.9,37.5 83.4,41 83.4,51.1 84.3,52 86.36,52 J7.D-
PA12
  Top 0.3: U3.P$45 79.09,38.01 79.09,38.09 82.4,41.4 82.4,51 84.2,52.8 86.36,52.8 J7.D+
PA13  (via drill 0.38)
  Top 0.3: U3.P$46 78.81,38.51 80.2,39.9 80.2,44.3 80.4,44.5 v80.4,60.3
  Bottom 0.3: v80.4,60.3 63.1,77.6 59.1,77.6 58,78.7 58,80.6 57.5,81.1 32.7,81.1 31.6,82.2 28,82.2 27.2,81.4 J36.P$3
PA14  (via drill 0.38)
  Top 0.3: U3.P$49 72.51,42.51 78.1,48.1 v78.1,59.5 | J36.P$4 57.5,81.1 58,80.6 58,77.5 59.6,75.9 62.3,75.9 v62.5,75.7
  Bottom 0.3: v62.5,75.7 62.5,75.1 v78.1,59.5
PA15
  Top 0.3: U3.P$50 72.01,43.31 72.9,44.2
PB0
  Top 0.3: U3.P$26 69.51,24.49 70.7,23.3 70.7,13.1 67.2,9.6 64.46,9.6 J12.P$4
PB1  (1 unrouted)
  Top 0.3: U3.P$27 70.01,25.29 71.7,23.6 71.7,12.5 72.5,11.7 75.4,11.7 76.9,10.2 76.9,7.48
PB2  (via drill 0.38)
  Top 0.25: U3.P$28 70.51,32.59 v68.8,34.3 | v63.3,60.2 63.3,60.8 63.7,61.2 63.7,62.08 U4.8
  Bottom 0.25: v68.8,34.3 68.8,49.4 63.3,54.9 v63.3,60.2
PB3
  Top 0.3: U3.P$55 69.51,45.81 70.1,46.4
PB4  (via drill 0.38)
  Top 0.3: U3.P$56 69.01,49.71 v70.6,51.3 | v71.4,65 71.4,67.1 76.9,72.6 v76.9,76.9
  Bottom 0.3: v70.6,51.3 70.6,51.6 71.4,52.4 v71.4,65 | v76.9,76.9 76.9,80.4 J26.P$1
PB5  (via drill 0.38)
  Top 0.3: U3.P$57 68.51,51.21 v69.9,52.6 | v66.9,77.7 68.2,77.7 69.9,76 v69.9,64.4
  Bottom 0.3: v69.9,52.6 v69.9,64.4 | v66.9,77.7 J22.P$1
PB6
  Top 0.3: U3.P$58 68.01,52.41 78,62.4 87.7,62.4 J2.P$3
PB7
  Top 0.3: U3.P$59 67.51,55.11 78.9,66.5 J2.P$1
PB10  (via drill 0.38)
  Top 0.3: U3.P$29 71.01,27.19 79.3,18.9 v81.8,18.9 | v91.6,18.8 91.8,19 91.8,44.4 90.1,46.1 90.1,72.3 89,73.4 J1.P$3
  Bottom 0.3: v91.6,18.8 81.9,18.8 v81.8,18.9
PB11  (via drill 0.38)
  Top 0.3: U3.P$30 71.51,27.49 79.2,19.8 v80.1,19.8 | v92,17.6 92.9,18.5 92.9,44.7 93.8,45.6 93.8,72.8 89.21,77.39 J1.P$1
  Bottom 0.3: v92,17.6 80.9,17.6 80.9,19 v80.1,19.8
PB15
  Top 0.3: U3.P$36 75.59,33.51 77,32.1
PC0
  Top 0.3: U3.P$8 58.01,36.01 56.6,34.6
PC1
  Top 0.3: U3.P$9 58.51,35.51 57,34
PC2
  Top 0.3: U3.P$10 58.91,35.01 57.4,33.5
PC3
  Top 0.3: U3.P$11 59.91,34.51 58,32.6
PC4
  Top 0.3: U3.P$24 68.51,23.49 68.9,23.1 68.9,13.8 66.7,11.6 54.2,11.6 52.4,9.8 34.68,9.8 J6.P$4
PC5
  Top 0.3: U3.P$25 69.01,24.09 69.7,23.4 69.7,13.5 66.8,10.6 54.3,10.6 52.6,8.9 49.04,8.9 J10.P$4
PC6
  Top 0.3: U3.P$37 75.79,34.01 77.4,32.4 82.8,32.4 84.2,33.8 85.5,33.8 85.8,33.5 85.8,31.3 86.8,30.3 86.8,13.2 88.6,11.4 J20.P$1
PC7
  Top 0.3: U3.P$38 75.99,34.51 77.5,33 82.3,33 84.1,34.8 85.9,34.8 86.6,34.1 86.6,31.9 87.4,31.1 87.4,22.7 J16.P$1
PC8
  Top 0.3: U3.P$39 76.19,35.01 77.6,33.6 81.7,33.6 83.7,35.6 86.4,35.6 87.3,34.7 87.3,33.3 89,31.6 J17.P$1
PC9
  Top 0.3: U3.P$40 81.71,35.51 86.6,40.4 J18.P$1
PC10  (via drill 0.38)
  Top 0.25: U4.23 63.67,56.12 v65.7,54.1 | 72.4,44.8 74.9,47.3 73.9,48.3 v70.4,48.3
  Top 0.3: 72.4,44.8 71.51,43.91 U3.P$51 71.51,40.49 72,40 v72.8,40 | 51.04,4.9 66.8,4.9 | 66.8,4.9 80.8,4.9 82.93,7.03 J15.P$1 82.9,7.48 82.9,9.2 85.7,12 85.7,24.1 85.1,24.7 | J6.P$1 40.82,4.9 51.04,4.9 | 51.04,4.9 J10.P$1 | J12.P$1 68.28,6.38 66.8,4.9 | R3.P$1 83.4,26.4 85.1,24.7 | 85.1,24.7 v85.1,27
  Bottom 0.25: v65.7,54.1 70.4,49.4 v70.4,48.3
  Bottom 0.3: v72.8,40 82.2,40 82.8,39.4 82.8,36.6 85,34.4 85,27.1 v85.1,27
PC11  (via drill 0.38)
  Top 0.25: U4.9 63.17,62.67 63.6,63.1 72.2,63.1 v72.8,62.5 | v72.8,47.3 72.8,46.5 71.7,45.4
  Top 0.3: 71.7,45.4 71.01,44.71 U3.P$52 v71.01,39.91 v71,39.9 | 83.2,20.8 83.2,14.3 79,10.1 79,7.52 J15.P$3 | 83.2,20.8 R7.P$1 | v83.9,21.3 83.7,21.3 83.2,20.8
  Bottom 0.25: v72.8,47.3 v72.8,62.5
  Bottom 0.3: J15.P$3 78.93,7.33 75.7,4.1 62.6,4.1 | 46.9,4.1 35.3,4.1 34.3,5.1 J6.P$3 | 46.9,4.1 62.6,4.1 | J10.P$3 49.46,6.66 46.9,4.1 | J12.P$3 64.28,5.78 62.6,4.1 | v71,39.9 71,39.7 71.8,38.9 81.2,38.9 81.8,38.3 81.8,33.8 84.2,31.4 84.2,21.6 v83.9,21.3
PC12  (via drill 0.38)
  Top 0.25: U4.24 64.17,57.33 v66.4,55.1 | 71,45.9 v71.5,46.4
  Top 0.3: 71,45.9 70.51,45.41 U3.P$53 70.51,40.71 69.9,40.1 v69.9,39 | v69.5,5.7 80.4,5.7 80.93,6.23 J15.P$2 80.9,7.48 80.9,9.5 84.7,13.3 84.7,23.5 83.5,24.7 R4.P$1 82.4,25.5 82.4,28 82.6,28.2 v82.6,31.6 | v53.9,5.7 v66.1,5.7 66.1,7.24 J12.P$2 | J10.P$2 50.1,5.96 v50.1,5.7 v41.9,5.7 | J6.P$2 36.3,6.7 v37.6,5.4
  Bottom 0.25: v66.4,55.1 66.4,54.3 71.5,49.2 v71.5,46.4
  Bottom 0.3: v66.1,5.7 v69.5,5.7 | v50.1,5.7 v53.9,5.7 | v41.9,5.7 37.9,5.7 v37.6,5.4 | v69.9,39 70,39 71,38 80.1,38 80.8,37.3 80.8,33.4 v82.6,31.6
RST  (via drill 0.38)
  Top 0.3: B1.P$2 B1.P$1 19.6,9.2 24.8,14.4 49.6,14.4 54.9,19.7 54.9,26.2 R8.P$1 54.8,35.1 56.21,36.51 58.3,36.51 | 58.3,36.51 U3.P$7 | J36.P$1 23.2,76.9 26.7,73.4 35.1,73.4 v37.1,71.4 | v41.1,71.4 41.1,62.7 v47.5,56.3 | v50.5,56.1 50.5,50.6 v54.3,46.8 | v54.2,44 54.2,40.61 58.3,36.51
  Bottom 0.3: v41.1,71.4 v37.1,71.4 | v47.5,56.3 50.3,56.3 v50.5,56.1 | v54.3,46.8 54.3,44.1 v54.2,44
VDD  (via drill 0.6)
  Top 0.25: C15.P$2 59.23,58.42 | C15.P$2 59.1,58.2 57.5,56.6 56.7,56.6 55.7,55.6 55.7,46.7 54.6,45.6 | 65.71,33.51 U3.P$13 | 65.71,33.51 68.35,36.15 | U3.P$19 66.01,33.21 65.71,33.51 | U3.P$32 72.51,31.99 68.8,35.7 | U4.13 60.27,61.48 59.2,60.4 59.2,58.4 C15.P$2
  Top 0.3: C7.P$2 63.5,43.22 U3.P$64 65.01,40.71 64.4,40.1 | C8.P$2 60.49,39.51 U3.P$1 64.41,39.51 64.7,39.8 | U3.P$13 61.31,33.51 61,33.2 C9.P$2 | U3.P$32 73.29,29.81 C10.P$2 76.7,26.4 R3.P$2 R4.P$2 R7.P$2 | U3.P$48 73.51,39.51 73.1,39.1 71.8,39.1 68.6,35.9 | U3.P$19 66,28.6 64.1,26.7 56.9,26.7 | 56.9,26.7 R8.P$2 | B2.P$3 B2.P$4 12.5,8.1 15.9,11.5 15.9,15.7 18.1,17.9 47.5,17.9 v51.4,21.8 | v56.5,21.8 56.5,26.3 56.9,26.7
  Top 0.5: U1.P$4 52.26,45.94 C2.P$2 54.6,45.6 58.9,45.6 64.4,40.1 64.7,39.8 68.35,36.15 68.6,35.9 68.8,35.7 | R2.P$1 53.9,57.4 55.7,55.6
  Bottom 0.3: v51.4,21.8 v56.5,21.8
VIN  (via drill 0.6)
  Top 1: U$4.P$2A 48.61,35.49 C4.P$2 48.5,31 45.9,28.4 18.7,28.4 v17.7,29.4 | v13.2,35.9 13.2,50.56 U$2.P$2A 13.7,53.7 13.18,54.22 8.62,54.22 | 8.62,54.22 J3.P$2 | 8.62,54.22 7.3,52.9 7.3,46.9 C3.P$2
  Bottom 1: v17.7,29.4 17.7,31.4 v13.2,35.9

### Text on the board
tPlace: PA8 | S G 5 | R G D C | 5 g - | PB5 | PB4 | T G R | UART 3 | PA10 | UART 1 | PC9 | 12V G - - | PC8 | PA4 | PC7 | PA6 | PA7 | PB1 | PC6 | S G 5 | PB0 | PC4 | PC5 | G S I O C | S G 5 | RST | PA5 | BOOT0